# EAGLE design rev2 (EAGLE 9.4.2)
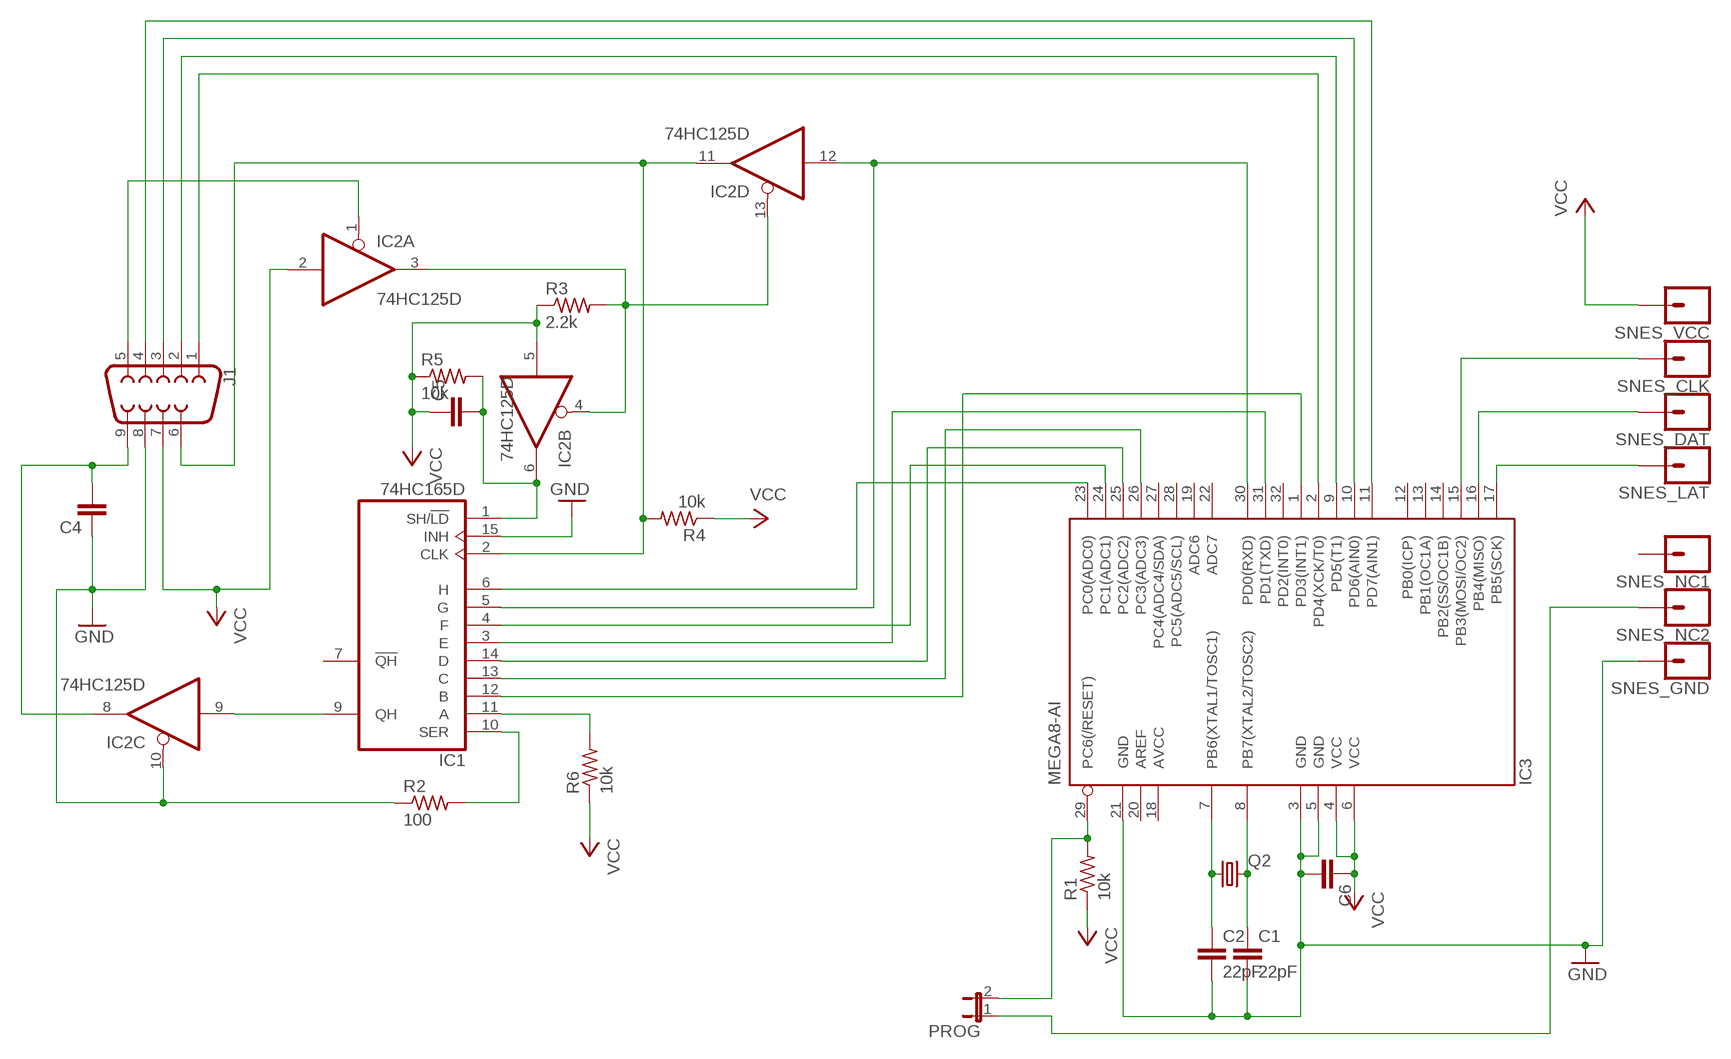
[diagram p0: schematic, sheet 1]

## Parts
C1  22pF  C-EUC1206  [C1206]
C2  22pF  C-EUC1206  [C1206]
C4  C-EUC1206  [C1206]
C5  C-EUC1206  [C1206]
C6  C-EUC1206  [C1206]
IC1  74HC165D  [SO16]
IC2  74HC125D  [SO14]
IC3  MEGA8-AI  [TQFP32-08]
J1  DB9FEMALE  [DB9]
PROG  JP1E  [JP1]
Q2  CRYSTALHC49S  [HC49/S]
R1  10k  R-US_R1206  [R1206]
R2  100  R-US_R1206  [R1206]
R3  2.2k  R-US_R1206  [R1206]
R4  10k  R-US_R1206  [R1206]
R5  10k  R-US_R1206  [R1206]
R6  10k  R-US_R1206  [R1206]
SNES_CLK  CONN_01PTH_2MM  [1X01_2MM]
SNES_DAT  CONN_01PTH_2MM  [1X01_2MM]
SNES_GND  CONN_01PTH_2MM  [1X01_2MM]
SNES_LAT  CONN_01PTH_2MM  [1X01_2MM]
SNES_NC1  CONN_01PTH_2MM  [1X01_2MM]
SNES_NC2  CONN_01PTH_2MM  [1X01_2MM]
SNES_VCC  CONN_01PTH_2MM  [1X01_2MM]

## Nets
GND: C1.2 C2.2 C4.1 C6.2 IC1.15(INH) IC2.10(C:OE) IC3.3(GND) IC3.5(GND) IC3.21(GND) J1.8 R2.1 SNES_GND.1
N$1: IC3.17(PB5(SCK)) SNES_LAT.1
N$2: IC3.16(PB4(MISO)) SNES_DAT.1
N$3: IC3.15(PB3(MOSI/OC2)) SNES_CLK.1
N$4: C2.1 IC3.7(PB6(XTAL1/TOSC1)) Q2.1
N$5: C1.1 IC3.8(PB7(XTAL2/TOSC2)) Q2.2
N$6: IC3.29(PC6(/RESET)) PROG.2 R1.2
N$7: IC3.11(PD7(AIN1)) J1.4
N$8: IC3.10(PD6(AIN0)) J1.3
N$9: IC3.9(PD5(T1)) J1.2
N$10: IC3.2(PD4(XCK/T0)) J1.1
N$11: C4.2 IC2.8(C:O) J1.9
N$12: IC1.9(QH) IC2.9(C:I)
N$13: IC2.1(A:OE) J1.5
N$14: IC1.10(SER) R2.2
N$15: C5.2 IC1.1(SH/!LD) IC2.6(B:O) R5.2
N$16: IC2.3(A:O) IC2.4(B:OE) IC2.13(D:OE) R3.2
N$17: IC1.2(CLK) IC2.11(D:O) J1.6 R4.2
N$18: PROG.1 SNES_NC2.1
N$19: IC1.12(B) IC3.1(PD3(INT1))
N$20: IC1.14(D) IC3.25(PC2(ADC2))
N$21: IC1.13(C) IC3.26(PC3(ADC3))
N$22: IC1.6(H) IC3.23(PC0(ADC0))
N$23: IC1.4(F) IC3.24(PC1(ADC1))
N$24: IC1.3(E) IC3.31(PD1(TXD))
N$25: IC1.5(G) IC2.12(D:I) IC3.30(PD0(RXD))
N$26: IC1.11(A) R6.2
VCC: C5.1 C6.1 IC2.2(A:I) IC2.5(B:I) IC3.4(VCC) IC3.6(VCC) J1.7 R1.1 R3.1 R4.1 R5.1 R6.1 SNES_VCC.1
Unconnected: IC1.7(!QH) IC3.12(PB0(ICP)) IC3.13(PB1(OC1A)) IC3.14(PB2(SS/OC1B)) IC3.19(ADC6) IC3.20(AREF) IC3.22(ADC7) IC3.27(PC4(ADC4/SDA)) IC3.28(PC5(ADC5/SCL)) IC3.32(PD2(INT0)) SNES_NC1.1

## Power pins joined to a net without a drawn wire
AVCC: IC3.18(AVCC)
GND: IC1.8(GND) IC2.7(P:GND)
VCC: IC1.16(VCC) IC2.14(P:VCC)

## Library data of the parts
C1 C2 C4-C6 = rcl:C-EU: CAPACITOR, European symbol; SPICEPREFIX: C
IC1 = 74xx-eu:74*165: 8-bit parallel load SHIFT REGISTER
IC2 = 74xx-eu:74*125: Quad bus BUFFER, 3-state
IC3 = atmel:MEGA8: MICROCONTROLLER 8 Kbytes FLASH, 1 kbytes SRAM, 512 bytes EEPROM, USART, 6-channel 10 bit ADC, 2-channel 8 bit ADC Pin compatible with Atmega48, ATMega88, ATMega168 Source: avr.lbr; MPN: ATMEGA8-16AU; OC_FARNELL: 9171371; OC_NEWARK: 73M8863
J1 = SparkFun-Connectors:DB9: DB9 Connector Standard DB9 (D-Sub 9) serial connector. Can be used for CAN bus as well as RS485 and RS232. Footprint production proven. Here is the female version connector we sell at SparkFun: 9 Pin Female Serial Connector - PCB Mount <https://www.sparkfun.com/products/429> (PRT-00429) This connector has been used on the following SparkFun products: SparkFun RS232 Shifter - SMD <https://www.sparkfun.com/products/449> (PRT-00449) SparkFun RS232 Shifter SMD (No DB9) <https://www.sparkfun.com/products/8780> (PRT-08780); PROD_ID: CONN-08194
PROG = jumper:JP1E: JUMPER
Q2 = adafruit:CRYSTAL: CRYSTAL; OC_FARNELL: 1667008; OC_NEWARK: unknown
R1-R6 = adafruit:R-US_: RESISTOR, American symbol
SNES_CLK SNES_DAT SNES_GND SNES_LAT SNES_NC1 SNES_NC2 SNES_VCC = SparkFun-Connectors:CONN_01: Single connection point. Often used as Generic Header-pin footprint for 0.1 inch spaced/style header connections On any of the 0.1 inch spaced packages, you can populate with these: Break Away Headers - Straight <https://www.sparkfun.com/products/116> (PRT-00116) Break Away Male Headers - Right Angle <https://www.sparkfun.com/products/553> (PRT-00553) Female Headers <https://www.sparkfun.com/products/115> (PRT-00115) Break Away Headers - Machine Pin <https://www.sparkfun.com/products/117> (PRT-00117) Break Away Female Headers - Swiss Machine Pin <https://www.sparkfun.com/products/743> (PRT-00743) This device is also useful as a general connection point to wire up your design to another part of your project. Our various solder wires solder well into these plated through hole pads. Hook-Up Wire - Assortment (Stranded, 22 AWG) <https://www.sparkfun.com/products/11375> (PRT-11375) Hook-Up Wire - Assortment (Solid Core, 22 AWG) <https://www.sparkfun.com/products/11367> (PRT-11367) View the entire wire category on our website here <https://www.sparkfun.com/categories/141> Special notes: SMTSO-256-ET is a "flush mount" nut for a 4-40 screw. We mostly use this on specialty testbeds; it is a nice way to connect hardware to your PCB at an adjustable hieght. Also note, the SNAP packages are for using a snappable style connector. We sell a baggie of snaps and they are also used on two LilyPad designs: Snap Assortment - 30 pack (male and female) <https://www.sparkfun.com/products/11347> (DEV-11347) LilyPad Arduino SimpleSnap <https://www.sparkfun.com/products/10941> (DEV-10941) LilyPad SimpleSnap Protoboard <https://www.sparkfun.com/products/10940> (DEV-10940)

## Board
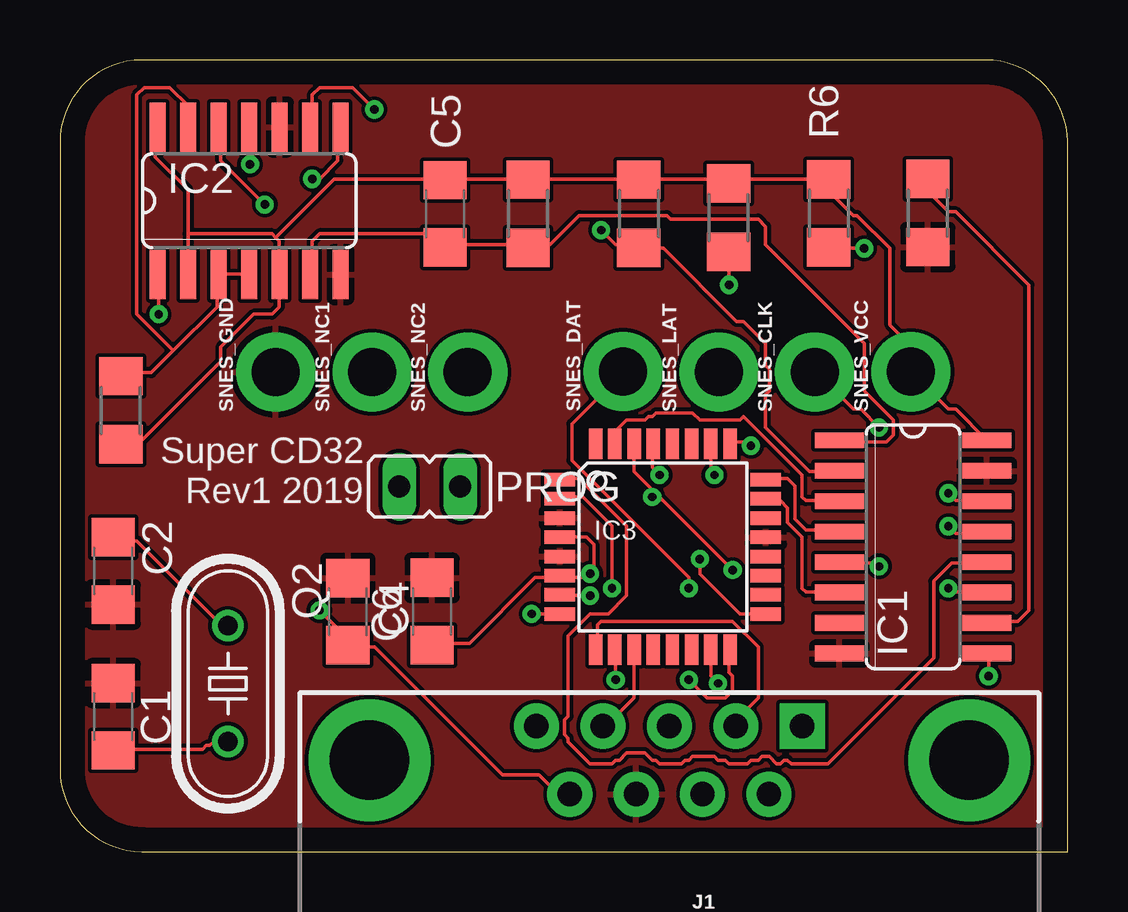
[diagram p1: board, top side]
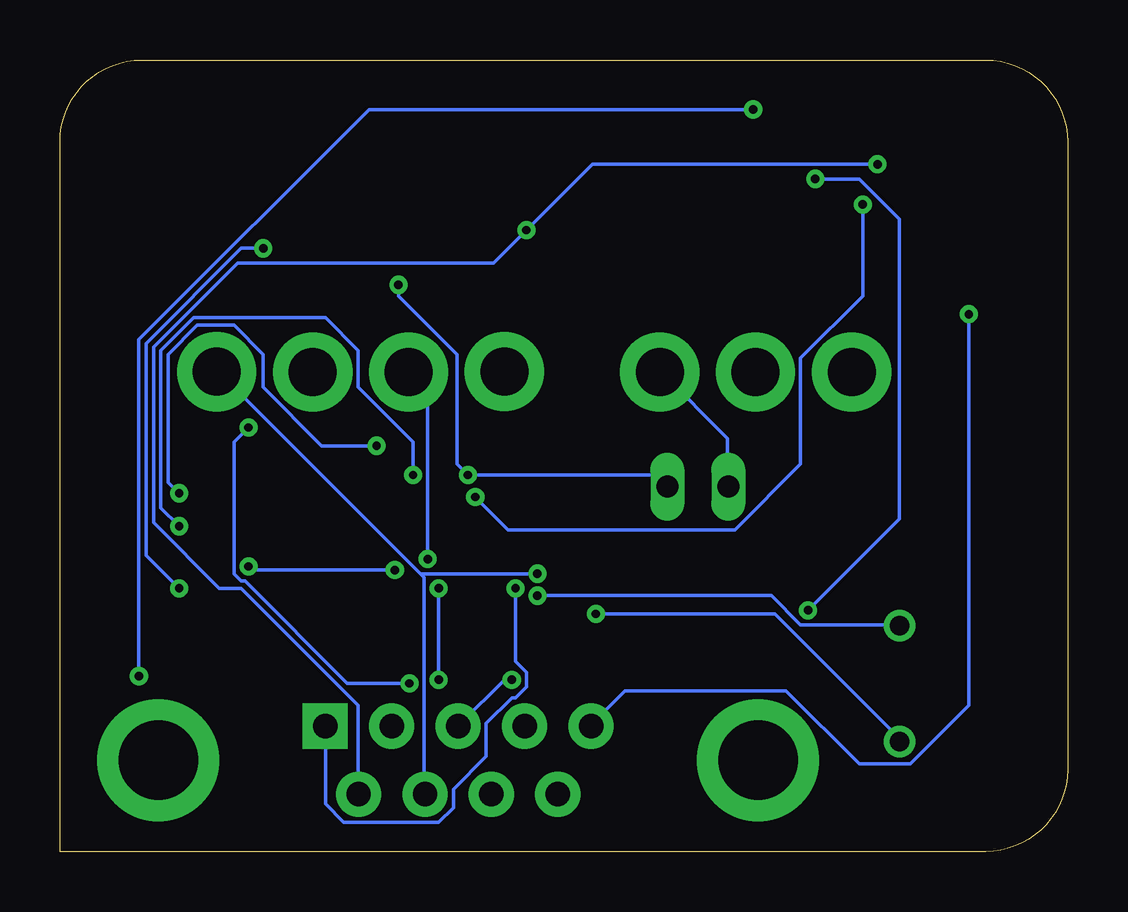
[diagram p2: board, bottom side, seen from below]

Size 42 x 33 mm. Coordinates in mm from the lower left corner, seen from the top.
Outline: 0,29.59 0,3.41 arc90 3.41,0 42,0 42,29.59 arc90 38.59,33 3.41,33 arc90 0,29.59
Copper layers (1*16): Top 0.035mm / dielectric 1.5mm / Bottom 0.035mm
Design rules "default": minimum track width 6mil, minimum drill 0.35mm, track to track 6mil, track to pad 6mil, pad to pad 6mil, via to via 6mil, smd to smd 6mil, copper to edge 40mil, drill to drill 6mil, minimum pad ring 10mil, minimum via ring 8mil, stop-mask expansion 4mil, vias tented up to drill 0mil, thermal gap 10mil

### Footprints (pad centres in the part's own frame; a part is rotated, then mirrored left to right if it is on the bottom)
C1206 = smd 1.6 x 1.8: 1 -1.4,0; 2 1.4,0
SO16 = smd 0.66 x 2.032: 1 -4.445,-3.073; 2 -3.175,-3.073; 3 -1.905,-3.073; 4 -0.635,-3.073; 5 0.635,-3.073; 6 1.905,-3.073; 7 3.175,-3.073; 8 4.445,-3.073; 9 4.445,3.073; 10 3.175,3.073; 11 1.905,3.073; 12 0.635,3.073; 13 -0.635,3.073; 14 -1.905,3.073; 15 -3.175,3.073; 16 -4.445,3.073
SO14 = smd 0.66 x 2.032: 1 -3.81,-3.073; 2 -2.54,-3.073; 3 -1.27,-3.073; 4 0,-3.073; 5 1.27,-3.073; 6 2.54,-3.073; 7 3.81,-3.073; 8 3.81,3.073; 9 2.54,3.073; 10 1.27,3.073; 11 0,3.073; 12 -1.27,3.073; 13 -2.54,3.073; 14 -3.81,3.073
TQFP32-08 = smd 1.27 x 0.559: 1 -4.293,2.8; 2 -4.293,2; 3 -4.293,1.2; 4 -4.293,0.4; 5 -4.293,-0.4; 6 -4.293,-1.2; 7 -4.293,-2; 8 -4.293,-2.8; 17 4.293,-2.8; 18 4.293,-2; 19 4.293,-1.2; 20 4.293,-0.4; 21 4.293,0.4; 22 4.293,1.2; 23 4.293,2; 24 4.293,2.8 | smd 0.559 x 1.27: 9 -2.8,-4.293; 10 -2,-4.293; 11 -1.2,-4.293; 12 -0.4,-4.293; 13 0.4,-4.293; 14 1.2,-4.293; 15 2,-4.293; 16 2.8,-4.293; 25 2.8,4.293; 26 2,4.293; 27 1.2,4.293; 28 0.4,4.293; 29 -0.4,4.293; 30 -1.2,4.293; 31 -2,4.293; 32 -2.8,4.293
DB9 = drill 1.016 pad 1.88 square: 1 -5.54,-1.42 | drill 1.016 pad 1.88: 2 -2.77,-1.42; 3 0,-1.42; 4 2.77,-1.42; 5 5.54,-1.42; 6 -4.15,1.42; 7 -1.38,1.42; 8 1.38,1.42; 9 4.15,1.42 | drill 3.302 pad 5.08: G1 -12.5,0; G2 12.5,0
JP1 = drill 0.914 long: 1 0,-1.27; 2 0,1.27
HC49/S = drill 0.813: 1 -2.413,0; 2 2.413,0
R1206 = smd 1.6 x 1.803: 1 -1.422,0; 2 1.422,0
1X01_2MM = drill 2 pad 3.302: 1 0,0

### Placement (x,y rotation side)
C1  2.22,5.62 90 top
C2  2.22,11.7 270 top
C4  12,10 270 top
C5  16.05,26.59 270 top
C6  15.51,10.01 90 top
IC1  35.56,12.7 270 top
IC2  7.89,27.13 0 top
IC3  25.13,12.7 0 top
J1  25.4,3.81 180 top
PROG  15.41,15.21 270 top
Q2  7,7 270 top
R1  27.87,26.43 270 top
R2  36.18,26.62 90 top
R3  2.54,18.4 90 top
R4  24.13,26.59 270 top
R5  19.51,26.59 270 top
R6  32.05,26.6 270 top
SNES_CLK  31.46,19.99 90 top
SNES_DAT  23.48,20.01 90 top
SNES_GND  9,19.99 90 top
SNES_LAT  27.47,19.99 90 top
SNES_NC1  13.01,19.99 90 top
SNES_NC2  17,19.99 90 top
SNES_VCC  35.47,20 90 top

### Tracks (layer width: path | path; a pad name or v marks a point on that pad's centre or on a via)
GND
  pour Top: 42,0 3.41,0 arc-90 0,3.41 0,29.59 arc-90 3.41,33 38.59,33 arc-90 42,29.59
N$1  (via drill 0.35)
  Top 0.152: v26.67,12.19 26.67,11.58 28.35,9.91 IC3.17
  Bottom 0.152: v26.67,12.19 26.67,19.2 27.43,19.96 SNES_LAT.1
N$2  (via drill 0.35)
  Top 0.152: v26.21,7.16 26.98,6.4 27.74,6.4 28.04,6.71 28.04,7.32 27.89,7.47 27.89,8.38 IC3.16 | v26.21,10.97 26.21,11.43 21.34,16.31 21.34,17.83 23.47,19.96 SNES_DAT.1
  Bottom 0.152: v26.21,10.97 v26.21,7.16
N$3  (via drill 0.35)
  Top 0.152: v27.43,7.01 27.13,7.32 27.13,8.38 IC3.15 | v34.14,17.68 33.38,18.44 33.07,18.44 31.55,19.96 SNES_CLK.1
  Bottom 0.152: v27.43,7.01 30.02,7.01 34.29,11.28 34.44,11.28 34.75,11.58 34.75,17.07 v34.14,17.68
N$4  (via drill 0.35)
  Top 0.152: v22.1,10.67 20.88,10.67 IC3.7 | C2.1 2.29,12.95 3.2,12.95 6.86,9.3 Q2.1
  Bottom 0.152: v22.1,10.67 12.34,10.67 11.12,9.45 7.01,9.45 Q2.1
N$5  (via drill 0.35)
  Top 0.152: v19.66,9.91 20.73,9.91 IC3.8 | C1.1 2.29,4.27 5.94,4.27 6.1,4.42 6.25,4.42 6.4,4.57 6.86,4.57 Q2.2
  Bottom 0.152: v19.66,9.91 12.19,9.91 7.01,4.72 Q2.2
N$6  (via drill 0.35)
  Top 0.152: v24.99,15.7 24.69,16 24.69,16.92 IC3.29 | v27.89,23.62 27.89,24.99 R1.2
  Bottom 0.152: PROG.2 16.76,15.24 17.22,15.7 v24.99,15.7 25.45,16.15 25.45,20.73 27.89,23.16 v27.89,23.62
N$7
  Top 0.152: IC3.11 23.93,8.38 23.93,6.4 22.71,5.18 J1.4
N$8  (via drill 0.35)
  Top 0.152: v23.16,7.16 23.16,8.38 IC3.10
  Bottom 0.152: v23.16,7.16 23.47,7.16 25.3,5.33 J1.3
N$9
  Top 0.152: IC3.9 22.4,8.53 22.4,9.45 22.55,9.6 28.04,9.6 29.11,8.53 29.11,6.4 28.04,5.33 J1.2
N$10  (via drill 0.35)
  Top 0.152: v23.01,10.97 23.01,13.56 21.79,14.78 20.88,14.78 IC3.2
  Bottom 0.152: v23.01,10.97 23.01,7.92 22.55,7.47 22.55,6.86 23.01,6.4 23.16,6.4 24.23,5.33 24.23,3.96 25.6,2.59 25.6,1.83 26.21,1.22 30.18,1.22 30.94,1.98 30.94,5.18 J1.1
N$11  (via drill 0.35)
  Top 0.152: J1.9 21.18,2.44 20.73,2.44 19.96,3.2 18.44,3.2 13.11,8.53 12.04,8.53 C4.2 11.89,8.69 11.89,8.99 v10.82,10.06 | v10.52,28.04 10.82,28.04 11.58,28.8 11.58,30.18 IC2.8
  Bottom 0.152: v10.52,28.04 8.69,28.04 7.01,26.36 7.01,13.87 v10.82,10.06
N$12  (via drill 0.35)
  Top 0.152: v13.11,30.94 12.19,31.85 10.82,31.85 10.52,31.55 10.52,30.33 IC2.9 | v38.71,7.32 38.71,8.23 IC1.9
  Bottom 0.152: v13.11,30.94 29.11,30.94 38.71,21.34 v38.71,7.32
N$13  (via drill 0.35)
  Top 0.152: v4.12,22.4 4.12,23.93 IC2.1
  Bottom 0.152: v4.12,22.4 4.12,6.1 6.55,3.66 8.69,3.66 11.73,6.71 18.44,6.71 19.81,5.33 J1.5
N$14
  Top 0.152: R2.2 36.27,28.04 36.27,27.43 37.03,26.67 37.34,26.67 40.39,23.62 40.39,10.06 39.93,9.6 38.71,9.6 IC1.10
N$15
  Top 0.152: IC2.6 10.52,24.08 10.52,25.45 10.82,25.76 15.54,25.76 16,25.3 C5.2 16.15,25.3 19.51,25.3 R5.2 19.66,25.3 20.42,25.3 21.64,26.52 25.3,26.52 25.45,26.36 29.11,26.36 29.41,26.06 29.41,25.3 33.53,21.18 33.53,19.2 34.75,17.98 34.75,17.37 34.44,17.07 32.61,17.07 IC1.1
N$16
  Top 0.152: 4.72,20.88 6.55,22.71 6.55,23.93 IC2.3 6.71,24.08 7.77,24.08 IC2.4 | 4.72,20.88 3.81,19.96 2.59,19.96 R3.2 | 4.72,20.88 3.2,22.4 3.2,31.55 3.5,31.85 4.57,31.85 5.33,31.09 5.33,30.33 IC2.13
N$17  (via drill 0.35)
  Top 0.152: IC1.2 32.46,15.85 31.24,15.85 29.41,17.68 29.41,19.05 29.57,19.2 29.57,20.12 29.41,20.27 29.41,21.18 28.5,22.1 28.19,22.1 25.15,25.15 24.23,25.15 R4.2 24.08,25.3 23.16,25.3 v22.55,25.91 | v7.92,28.65 7.92,30.18 IC2.11
  Bottom 0.152: v7.92,28.65 19.81,28.65 v22.55,25.91 23.93,24.54 34.59,24.54 38.1,21.03 38.1,13.72 35.36,10.97 34.44,10.97 29.57,6.1 29.57,2.44 J1.6
N$18
  Bottom 0.152: PROG.1 14.17,15.24 14.17,17.22 16.92,19.96 SNES_NC2.1
N$19
  Top 0.152: IC3.1 20.88,15.54 21.64,15.54 23.62,13.56 23.62,10.67 22.86,9.91 22.1,9.91 21.18,8.99 21.18,5.64 21.03,5.49 21.03,4.88 21.18,4.72 21.18,4.57 22.1,3.66 23.01,3.66 23.16,3.81 23.32,3.81 23.62,4.12 24.38,4.12 24.69,3.81 24.84,3.81 24.99,3.66 25.91,3.66 26.06,3.81 26.21,3.81 26.36,3.96 27.28,3.96 27.43,3.81 27.74,3.81 27.89,3.66 28.65,3.66 28.8,3.81 29.11,3.81 29.26,3.96 29.57,3.96 29.87,3.66 30.02,3.66 30.18,3.81 30.33,3.81 30.48,3.66 32,3.66 36.42,8.08 36.42,11.28 37.19,12.04 38.56,12.04 IC1.12
N$20  (via drill 0.35)
  Top 0.152: v28.8,16.92 28.65,17.07 28.04,17.07 IC3.25 | v37.03,14.94 37.34,14.63 38.56,14.63 IC1.14
  Bottom 0.152: v28.8,16.92 31.09,16.92 33.53,19.36 33.53,20.73 34.75,21.95 36.27,21.95 37.49,20.73 37.49,15.39 v37.03,14.94
N$21  (via drill 0.35)
  Top 0.152: v27.28,15.7 27.13,15.85 27.13,16.92 IC3.26 | v37.03,13.56 37.34,13.26 38.56,13.26 IC1.13
  Bottom 0.152: v27.28,15.7 27.28,17.07 29.57,19.36 29.57,20.88 30.94,22.25 36.42,22.25 37.8,20.88 37.8,14.33 v37.03,13.56
N$22
  Top 0.152: IC3.23 29.57,14.63 30.02,14.63 30.33,14.33 30.33,13.72 30.94,13.11 30.94,10.97 31.09,10.82 32.46,10.82 IC1.6
N$23
  Top 0.152: IC3.24 29.57,15.54 30.33,15.54 30.63,15.24 30.63,13.87 31.09,13.41 32.46,13.41 IC1.4
N$24
  Top 0.152: IC3.31 23.16,17.07 23.16,17.53 23.62,17.98 24.38,17.98 24.54,18.14 24.69,18.14 24.84,18.29 26.36,18.29 26.67,17.98 28.35,17.98 28.5,18.14 30.94,15.7 30.94,14.78 31.09,14.63 32.46,14.63 IC1.3
N$25  (via drill 0.35)
  Top 0.152: v28.04,11.73 24.84,14.94 | 24.84,14.94 23.93,15.85 23.93,16.92 IC3.30 | v34.14,11.89 33.98,12.04 32.61,12.04 IC1.5 | v8.53,26.98 6.71,28.8 6.71,30.18 IC2.12 | 24.84,14.94 v24.69,14.78
  Bottom 0.152: v28.04,11.73 33.98,11.73 v34.14,11.89 | v8.53,26.98 8.53,23.16 11.12,20.57 11.12,16.15 13.87,13.41 23.32,13.41 v24.69,14.78
N$26  (via drill 0.35)
  Top 0.152: v33.53,25.15 32.16,25.15 R6.2 | v37.03,10.97 37.19,10.97 37.34,10.82 38.56,10.82 IC1.11
  Bottom 0.152: v33.53,25.15 34.44,25.15 38.41,21.18 38.41,12.34 v37.03,10.97
VCC  (via drill 0.35)
  Top 0.152: 5.33,25.76 5.33,27.58 3.96,28.96 3.96,30.18 IC2.14 | 5.33,25.76 5.33,24.08 IC2.2 | R3.1 2.59,17.07 3.35,17.07 6.71,20.42 6.71,21.03 8.08,22.4 8.84,22.4 9.14,22.71 9.14,23.93 IC2.5 9.14,24.08 9.14,25.45 8.99,25.6 | 5.33,25.76 8.84,25.76 8.99,25.6 | 8.99,25.6 11.43,28.04 16,28.04 C5.1 16.15,28.04 19.51,28.04 R5.1 19.66,28.04 24.08,28.04 R4.1 24.23,28.04 27.58,28.04 27.74,27.89 R1.1 27.89,27.89 28.04,28.04 32,28.04 R6.1 32.16,27.89 32.16,27.43 33.07,26.52 33.22,26.52 34.59,25.15 34.59,21.95 35.36,21.18 35.36,20.12 SNES_VCC.1 35.51,19.96 37.03,18.44 37.34,18.44 IC1.16 | IC3.4 20.88,13.11 21.95,13.11 22.25,12.8 22.25,11.73 v22.1,11.58 21.95,11.43 20.88,11.43 IC3.6 20.73,11.43 19.81,11.43 17.07,8.69 15.54,8.69 C6.1
  Bottom 0.152: 26.98,11.58 35.36,19.96 SNES_VCC.1 | 26.98,11.58 26.82,11.43 26.82,2.44 J1.7 | 26.98,11.58 v22.1,11.58

### Text on the board
tNames: Super CD32 / Rev1 2019